# Altium project Proyecto_TD3.PrjPcb
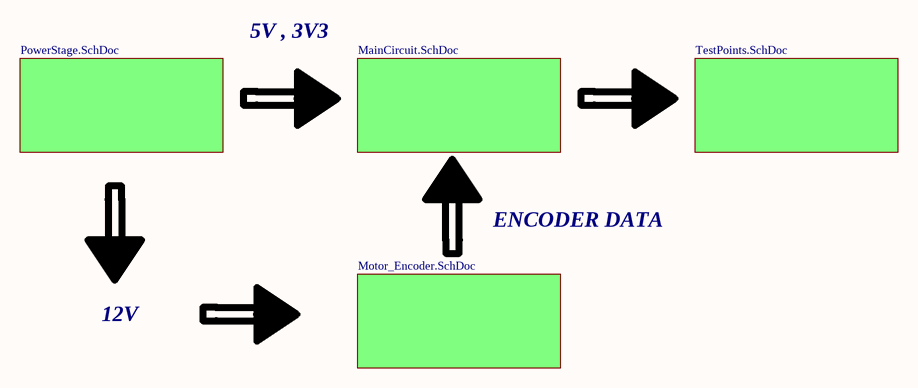
[diagram p0: Main_Sch.SchDoc]
5 sheets, 57 parts. Net scope: global (net labels, ports and power ports of the same name join across sheets).
Board file: PCB3.PcbDoc
Sheets:
  Main_Sch.SchDoc
    Designator = MainCircuit.SchDoc
    Designator = PowerStage.SchDoc
    Designator = Motor_Encoder.SchDoc
    Designator = TestPoints.SchDoc

## Sheet Main_Sch.SchDoc: Controlador PID
size A4; Organization: Altium Limited; Address1: L3, 12a Rodborough Rd; Address2: Frenchs Forest; Address3: NSW; Address4: Australia 2086; Revision: R01; sheetnumberh: 1; sheettotall: 5; Alumno: Irumberry Juan - Matwiejczuk Leandro; Curso: 512; Materia: Técnicas Digitales III; Docentes: Ing. Marín Ariel; SheetNumber: 1; SheetTotal: 5

### Sub-sheets
Designator = MainCircuit.SchDoc: no entries
Designator = PowerStage.SchDoc: no entries
Designator = Motor_Encoder.SchDoc: no entries
Designator = TestPoints.SchDoc: no entries

### Notes on the sheet
- 5V , 3V3
- ENCODER DATA
- 12V
- Title:
- Revision:
- Alumnos:
- Materia:
- Docente:
- Curso:
- File:
- Date:
- Sheet
- of

## Sheet MainCircuit.SchDoc: Controlador PID
size A4; Organization: Altium Limited; Address1: L3, 12a Rodborough Rd; Address2: Frenchs Forest; Address3: NSW; Address4: Australia 2086; Revision: R01; sheetnumberh: 2; sheettotall: 5; Alumno: Irumberry Juan - Matwiejczuk Leandro; Curso: 512; Materia: Técnicas Digitales III; Docentes: Ing. Marín Ariel; SheetNumber: 2; SheetTotal: 5
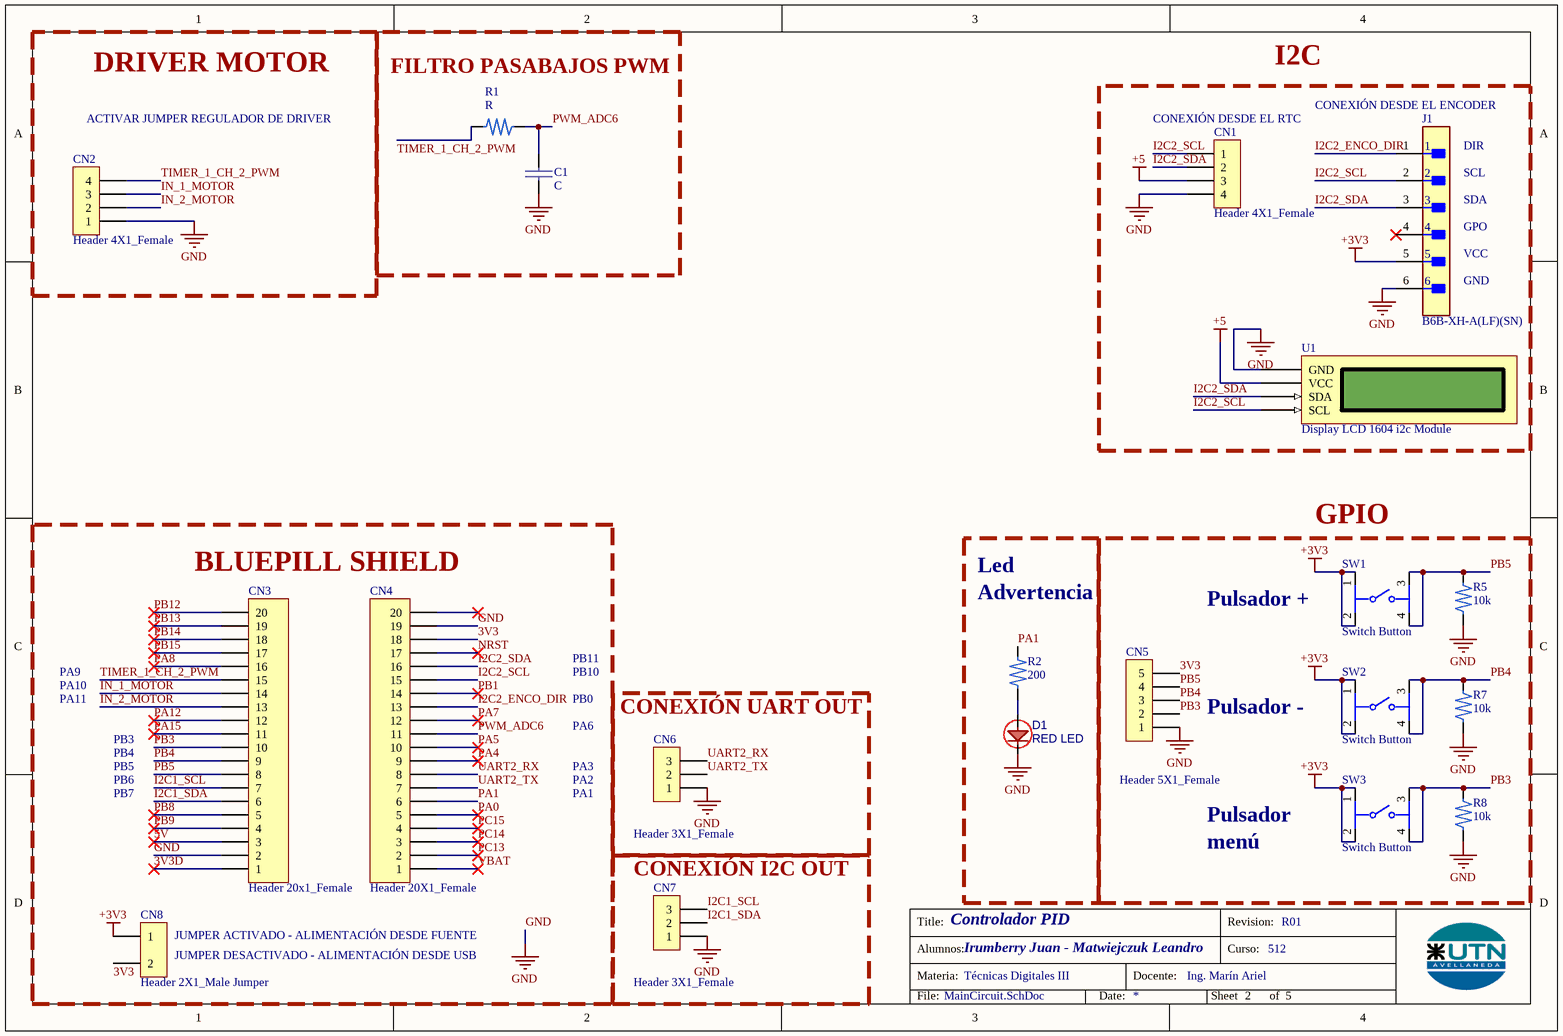
[diagram p1: MainCircuit.SchDoc]

### Parts
C1  C  [CAP_Axial_0.2mm]
CN1  Header 4X1_Female  [1*4P_FEMALE]
CN2  Header 4X1_Female  [1*4P_FEMALE]
CN3  Header 20x1_Female  [1*20P_FEMALE]
CN4  Header 20X1_Female  [1*20P_FEMALE]
CN5  Header 5X1_Female  [1*5P_FEMALE]
CN6  Header 3X1_Female  [1*3P_FEMALE]
CN7  Header 3X1_Female  [1*3P_FEMALE]
CN8  Header 2X1_Male Jumper  [JUMPER 2x1 PIN]
D1  RED LED  [LED_DIODE_3.9mm]
J1  B6B-XH-A(LF)(SN)  [JST 6 PIN CONNECTOR]
R1  R  [RES_AXIAL_3.2_6MM]
R2  200  [RES_AXIAL_3.2_6MM]
R5  10k  [RES_AXIAL_3.2_6MM]  (graphical)
R7  10k  [RES_AXIAL_3.2_6MM]  (graphical)
R8  10k  [RES_AXIAL_3.2_6MM]  (graphical)
SW1  Switch Button  [SWITCH]  (graphical)
SW2  Switch Button  [SWITCH]  (graphical)
SW3  Switch Button  [SWITCH]  (graphical)
U1  Display LCD 1604 i2c Module  [1*4P_FEMALE]

### Blocks framed on the sheet
DRIVER MOTOR: CN2
FILTRO PASABAJOS PWM: C1 R1
I2C: CN1 J1 U1
BLUEPILL SHIELD: CN3 CN4 CN8
GPIO: CN5 R5 R7 R8 SW1-SW3
CONEXIÓN UART OUT: CN6
CONEXIÓN I2C OUT: CN7

### Nets
+3V3: CN8.1 J1.5 SW1.1 SW1.2 SW2.1 SW2.2 SW3.1 SW3.2
+5: CN1.3 U1.2(VCC)
GND: C1.2 CN1.4 CN2.1 CN3.2 CN4.19 CN5.1 CN6.1 CN7.1 D1.K J1.6 R5.1 R7.1 R8.1 U1.1(GND)
3V3: CN4.18 CN5.5 CN8.2
3V3D: CN3.1
5V: CN3.3
I2C1_SCL: CN3.7 CN7.3
I2C1_SDA: CN3.6 CN7.2
I2C2_ENCO_DIR: CN4.13 J1.1
I2C2_SCL: CN1.1 CN4.15 J1.2 U1.4(SCL)
I2C2_SDA: CN1.2 CN4.16 J1.3 U1.3(SDA)
IN_1_MOTOR: CN2.3 CN3.14
IN_2_MOTOR: CN2.2 CN3.13
NRST: CN4.17
PA0: CN4.5
PA1: CN4.6 R2.2
PA4: CN4.9
PA5: CN4.10
PA7: CN4.12
PA8: CN3.16
PA12: CN3.12
PA15: CN3.11
PB1: CN4.14
PB3: CN3.10 CN5.2 R8.2 SW3.3 SW3.4
PB4: CN3.9 CN5.3 R7.2 SW2.3 SW2.4
PB5: CN3.8 CN5.4 R5.2 SW1.3 SW1.4
PB8: CN3.5
PB9: CN3.4
PB12: CN3.20
PB13: CN3.19
PB14: CN3.18
PB15: CN3.17
PC13: CN4.2
PC14: CN4.3
PC15: CN4.4
PWM_ADC6: C1.1 CN4.11 R1.2
TIMER_1_CH_2_PWM: CN2.4 CN3.15 R1.1
UART2_RX: CN4.8 CN6.3
UART2_TX: CN4.7 CN6.2
VBAT: CN4.1
NetD1_A: D1.A R2.1

Not connected (* = marked no-connect by the designer): CN4 20*; J1 4*

### Notes on the sheet
- (near J1) CONEXIÓN DESDE EL ENCODER
- ACTIVAR JUMPER REGULADOR DE DRIVER
- (near CN1) CONEXIÓN DESDE EL RTC
- (near J1) DIR
- (near J1) SCL
- (near J1) SDA
- (near J1) GPO
- (near J1) VCC
- (near J1) GND
- Led
- Advertencia
- (near SW1) Pulsador +
- PA9
- PA10
- PA11
- PB10
- PB11
- PB0
- Pulsador -
- PB6
- PB3
- PB4
- PB5
- PA6
- PA2
- PA3
- PB7
- PA1
- Pulsador
- menú
- (near CN8) JUMPER ACTIVADO - ALIMENTACIÓN DESDE FUENTE
- (near CN8) JUMPER DESACTIVADO - ALIMENTACIÓN DESDE USB
- Title:
- Revision:
- Alumnos:
- Materia:
- Docente:
- Curso:
- File:
- Date:
- Sheet
- of

### Library data of the parts
C1 = CAP_NP: Non-Polarized Capacitor
CN1 CN2 = Header 4X1_Female: Header, 4-Pin, Single row,female; LatestRevisionDate: 17-Jul-2002; LatestRevisionNote: Re-released for DXP Platform.; Publisher: Altium Limited
CN3 CN4 = Header 20x1_Female: Header, 16-Pin, Single row,female
CN5 = Header 5X1_Female: Header, 5-Pin, Single row,female; LatestRevisionDate: 17-Jul-2002; LatestRevisionNote: Re-released for DXP Platform.; Publisher: Altium Limited
CN6 CN7 = Header 3X1_Female: Header, 3-Pin, Single row,female; LatestRevisionDate: 17-Jul-2002; LatestRevisionNote: Re-released for DXP Platform.; Publisher: Altium Limited
CN8 = Jumper 2 Pin: Header, 2-Pin, Single row,male; LatestRevisionDate: 17-Jul-2002; LatestRevisionNote: Re-released for DXP Platform.; Publisher: Altium Limited
D1 = LED
J1 = JST 6 PIN: CONN HEADER VERT 6POS 2.5MM
R1 R2 R5 R7 R8 = RES: Through-hole Resistor
SW1-SW3 = Switch Button: SWITCH TACTILE SPST-NO 0.05A 24V; Manufacturer: TE Connectivity; Manufacturer Part Number: 1-1825910-4; Operating Force: 160gf; Contact Current Rating: 50mA; Electromechanical Life: 100000Cycles; Contact Resistance: 100mΩ; Octopart: https://octopart.com/1-1825910-4-te+connectivity-42270468; ComponentLink2URL: https://www.te.com/commerce/DocumentDelivery/DDEController?Action=showdoc&DocId=Customer+Drawing%7F1825910%7FC10%7Fpdf%7FEnglish%7FENG_CD_1825910_C10.pdf%7F1-1825910-4; Throw Configuration: SPST-NO; Height: 9.8mm; Package: 1-1825910-4; Automotive: No; Device Class L2: Switches; Voltage Rating Dc: 24V; Temperature Range High: +85°C; Device Class L3: Tactile Switches; Mouser Description: Tactile Switches 6MM ACTHIGH TEMP TACT SWITCH; Lead Free: Yes; Temperature Range Low: -35°C; Digikey Description: SWITCH TACTILE SPST-NO 0.05A 24V; Device Class L1: Electromechanical; Mount: Through Hole; RoHS: TRUE; ComponentLink2Description: Datasheet; Temperature: -35°C to +85°C; Category: Switch

## Sheet PowerStage.SchDoc: Controlador PID
size A4; Organization: Altium Limited; Address1: L3, 12a Rodborough Rd; Address2: Frenchs Forest; Address3: NSW; Address4: Australia 2086; Revision: R01; sheetnumberh: 3; sheettotall: 5; Alumno: Irumberry Juan - Matwiejczuk Leandro; Curso: 512; Materia: Técnicas Digitales III; Docentes: Ing. Marín Ariel; SheetNumber: 3; SheetTotal: 5
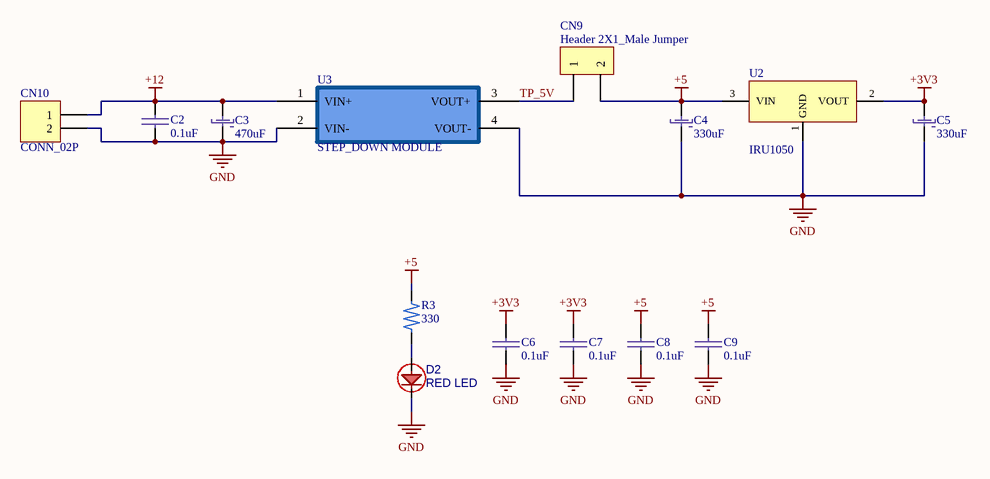
[diagram p2: PowerStage.SchDoc]

### Parts
(Parts that share a designator on the sheet are numbered #1, #2 ... from top to bottom, then left to right.)
C2  0.1uF  [CAP_Axial_0.2mm]
C3  470uF  [C_RAD_11MM]
C4  330uF  [C_RAD_5mm]
C5  330uF  [C_RAD_5mm]
C6  0.1uF  [CAP_Axial_0.2mm]
C7#1  0.1uF  [CAP_Axial_0.2mm]
C8  0.1uF  [CAP_Axial_0.2mm]
C9  0.1uF  [CAP_Axial_0.2mm]
CN9  Header 2X1_Male Jumper  [JUMPER 2x1 PIN]
CN10  CONN_02P  [TERMINAL_BLOCK_2_PIN]
D2  RED LED  [LED_DIODE_3.9mm]
R3  330  [RES_AXIAL_3.2_6MM]
U2  IRU1050  [IRU1050]
U3  STEP_DOWN MODULE  [STEP_DOWN_MODULE]

### Nets
+3V3: C5.1 C6.1 C7#1.1 U2.2(VOUT)
+5: C4.1 C8.1 C9.1 CN9.2 R3.2 U2.3(VIN)
+12: C2.1 C3.1 CN10.1 U3.1(VIN+)
GND: C2.2 C3.2 C4.2 C5.2 C6.2 C7#1.2 C8.2 C9.2 CN10.2 D2.K U2.1(GND) U3.2(VIN-) U3.4(VOUT-)
TP_5V: CN9.1 U3.3(VOUT+)
NetD2_A: D2.A R3.1

### Notes on the sheet
- Title:
- Revision:
- Alumnos:
- Materia:
- Docente:
- Curso:
- File:
- Date:
- Sheet
- of

### Library data of the parts
C2 C6 C7#1 C8 C9 = CAP_NP: Non-Polarized Capacitor
C3-C5 = Cap_Pol: Polarized Capacitor
CN9 = Jumper 2 Pin: Header, 2-Pin, Single row,male; LatestRevisionDate: 17-Jul-2002; LatestRevisionNote: Re-released for DXP Platform.; Publisher: Altium Limited
CN10 = CONN_02P: Connector Generic 2 Vias
D2 = LED
R3 = RES: Through-hole Resistor
U2 = IRU1050-33: 5A  FIXED 3V3 LOW DROPOUT POSITIVE ADJUSTABLE REGULATOR
U3 = STEP_DOWN_MODULE

## Sheet Motor_Encoder.SchDoc: Controlador PID
size A4; Organization: Altium Limited; Address1: L3, 12a Rodborough Rd; Address2: Frenchs Forest; Address3: NSW; Address4: Australia 2086; Revision: R01; sheetnumberh: 4; sheettotall: 5; Alumno: Irumberry Juan - Matwiejczuk Leandro; Curso: 512; Materia: Técnicas Digitales III; Docentes: Ing. Marín Ariel; SheetNumber: 4; SheetTotal: 5
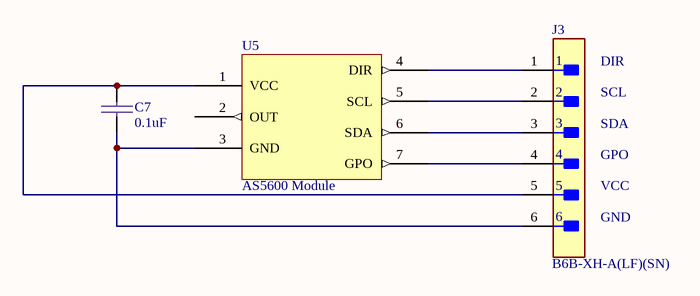
[diagram p3: Motor_Encoder.SchDoc]

### Parts
(Parts that share a designator on the sheet are numbered #1, #2 ... from top to bottom, then left to right.)
C7#2  0.1uF  [CAP_Axial_0.2mm]  (graphical)
J3  B6B-XH-A(LF)(SN)  [JST 6 PIN CONNECTOR]  (graphical)
U5  AS5600 Module  [AS5600 Module]  (graphical)

### Nets
NetC7#2_1: C7#2.1 J3.5 U5.1(VCC)
NetC7#2_2: C7#2.2 J3.6 U5.3(GND)
NetJ3_1: J3.1 U5.4(DIR)
NetJ3_2: J3.2 U5.5(SCL)
NetJ3_3: J3.3 U5.6(SDA)
NetJ3_4: J3.4 U5.7(GPO)

Not connected (* = marked no-connect by the designer): U5 2(OUT)

### Notes on the sheet
- (near J3) DIR
- (near J3) SCL
- (near J3) SDA
- (near J3) GPO
- (near J3) VCC
- (near J3) GND
- Title:
- Revision:
- Alumnos:
- Materia:
- Docente:
- Curso:
- File:
- Date:
- Sheet
- of

### Library data of the parts
C7#2 = CAP_NP: Non-Polarized Capacitor
J3 = JST 6 PIN: CONN HEADER VERT 6POS 2.5MM
U5 = AS5600 Module: AS5600 Magnetic Angle Sensor Encoder Module

## Sheet TestPoints.SchDoc: Controlador PID
size A4; Organization: Altium Limited; Address1: L3, 12a Rodborough Rd; Address2: Frenchs Forest; Address3: NSW; Address4: Australia 2086; Revision: R01; sheetnumberh: 5; sheettotall: 5; Alumno: Irumberry Juan - Matwiejczuk Leandro; Curso: 512; Materia: Técnicas Digitales III; Docentes: Ing. Marín Ariel; SheetNumber: 5; SheetTotal: 5
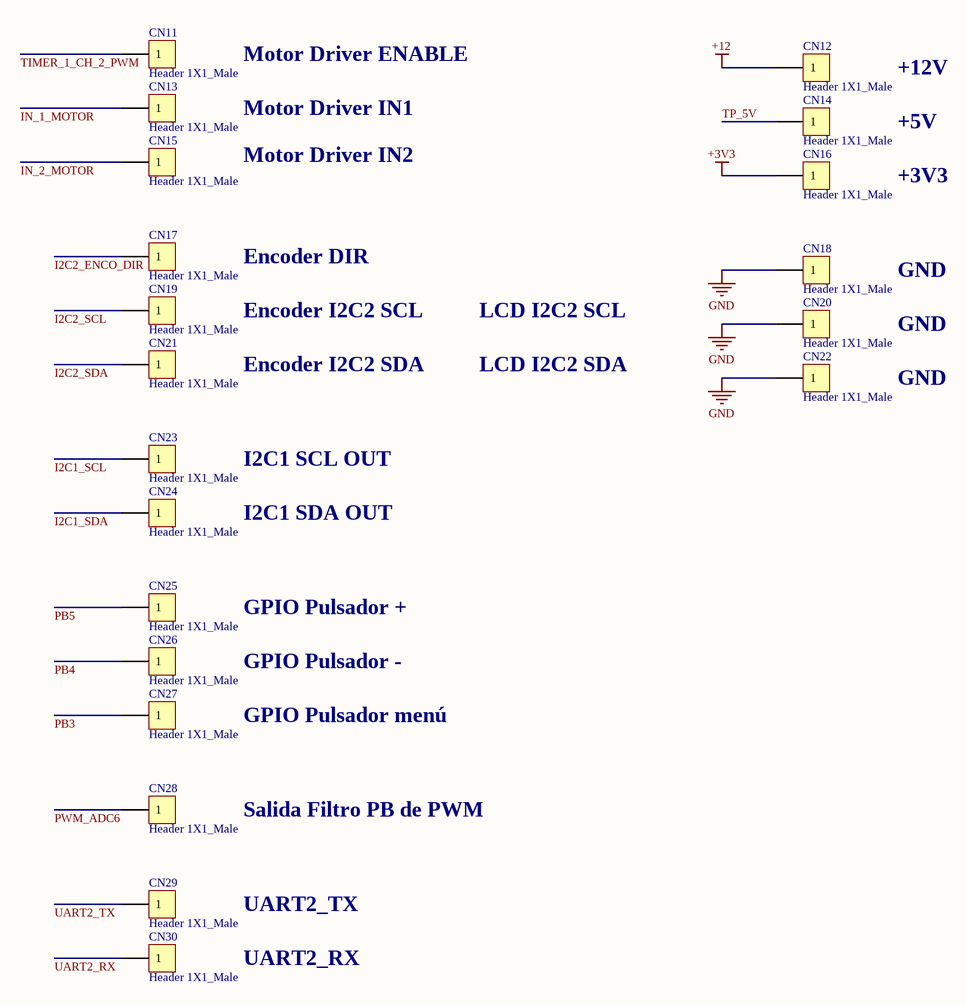
[diagram p4: TestPoints.SchDoc]

### Parts
CN11  Header 1X1_Male  [1*1P_MALE]
CN12  Header 1X1_Male  [1*1P_MALE]
CN13  Header 1X1_Male  [1*1P_MALE]
CN14  Header 1X1_Male  [1*1P_MALE]
CN15  Header 1X1_Male  [1*1P_MALE]
CN16  Header 1X1_Male  [1*1P_MALE]
CN17  Header 1X1_Male  [1*1P_MALE]
CN18  Header 1X1_Male  [1*1P_MALE]
CN19  Header 1X1_Male  [1*1P_MALE]
CN20  Header 1X1_Male  [1*1P_MALE]
CN21  Header 1X1_Male  [1*1P_MALE]
CN22  Header 1X1_Male  [1*1P_MALE]
CN23  Header 1X1_Male  [1*1P_MALE]
CN24  Header 1X1_Male  [1*1P_MALE]
CN25  Header 1X1_Male  [1*1P_MALE]
CN26  Header 1X1_Male  [1*1P_MALE]
CN27  Header 1X1_Male  [1*1P_MALE]
CN28  Header 1X1_Male  [1*1P_MALE]
CN29  Header 1X1_Male  [1*1P_MALE]
CN30  Header 1X1_Male  [1*1P_MALE]

### Nets
+3V3: CN16.1
+12: CN12.1
GND: CN18.1 CN20.1 CN22.1
I2C1_SCL: CN23.1
I2C1_SDA: CN24.1
I2C2_ENCO_DIR: CN17.1
I2C2_SCL: CN19.1
I2C2_SDA: CN21.1
IN_1_MOTOR: CN13.1
IN_2_MOTOR: CN15.1
PB3: CN27.1
PB4: CN26.1
PB5: CN25.1
PWM_ADC6: CN28.1
TIMER_1_CH_2_PWM: CN11.1
TP_5V: CN14.1
UART2_RX: CN30.1
UART2_TX: CN29.1

### Notes on the sheet
- Motor Driver ENABLE
- +12V
- Motor Driver IN1
- +5V
- Motor Driver IN2
- +3V3
- Encoder DIR
- GND
- Encoder I2C2 SCL
- LCD I2C2 SCL
- Encoder I2C2 SDA
- LCD I2C2 SDA
- I2C1 SCL OUT
- I2C1 SDA OUT
- GPIO Pulsador +
- GPIO Pulsador -
- GPIO Pulsador menú
- Salida Filtro PB de PWM
- UART2_TX
- UART2_RX
- Title:
- Revision:
- Alumnos:
- Materia:
- Docente:
- Curso:
- File:
- Date:
- Sheet
- of

### Library data of the parts
CN11-CN30 = Header 1X1_Male: Header, 1-Pin, Single row,male; LatestRevisionDate: 17-Jul-2002; LatestRevisionNote: Re-released for DXP Platform.; Publisher: Altium Limited

## Nets that join several sheets
+3V3: MainCircuit (8 pins), PowerStage (C5.1 C6.1 C7#1.1 U2.2), TestPoints (CN16.1)
+5: MainCircuit (CN1.3 U1.2), PowerStage (6 pins)
+12: PowerStage (C2.1 C3.1 CN10.1 U3.1), TestPoints (CN12.1)
GND: MainCircuit (14 pins), PowerStage (13 pins), TestPoints (CN18.1 CN20.1 CN22.1)
I2C1_SCL: MainCircuit (CN3.7 CN7.3), TestPoints (CN23.1)
I2C1_SDA: MainCircuit (CN3.6 CN7.2), TestPoints (CN24.1)
I2C2_ENCO_DIR: MainCircuit (CN4.13 J1.1), TestPoints (CN17.1)
I2C2_SCL: MainCircuit (CN1.1 CN4.15 J1.2 U1.4), TestPoints (CN19.1)
I2C2_SDA: MainCircuit (CN1.2 CN4.16 J1.3 U1.3), TestPoints (CN21.1)
IN_1_MOTOR: MainCircuit (CN2.3 CN3.14), TestPoints (CN13.1)
IN_2_MOTOR: MainCircuit (CN2.2 CN3.13), TestPoints (CN15.1)
PB3: MainCircuit (5 pins), TestPoints (CN27.1)
PB4: MainCircuit (5 pins), TestPoints (CN26.1)
PB5: MainCircuit (5 pins), TestPoints (CN25.1)
PWM_ADC6: MainCircuit (C1.1 CN4.11 R1.2), TestPoints (CN28.1)
TIMER_1_CH_2_PWM: MainCircuit (CN2.4 CN3.15 R1.1), TestPoints (CN11.1)
TP_5V: PowerStage (CN9.1 U3.3), TestPoints (CN14.1)
UART2_RX: MainCircuit (CN4.8 CN6.3), TestPoints (CN30.1)
UART2_TX: MainCircuit (CN4.7 CN6.2), TestPoints (CN29.1)